# EAGLE design boardShildSchematic (EAGLE 6.6.0)
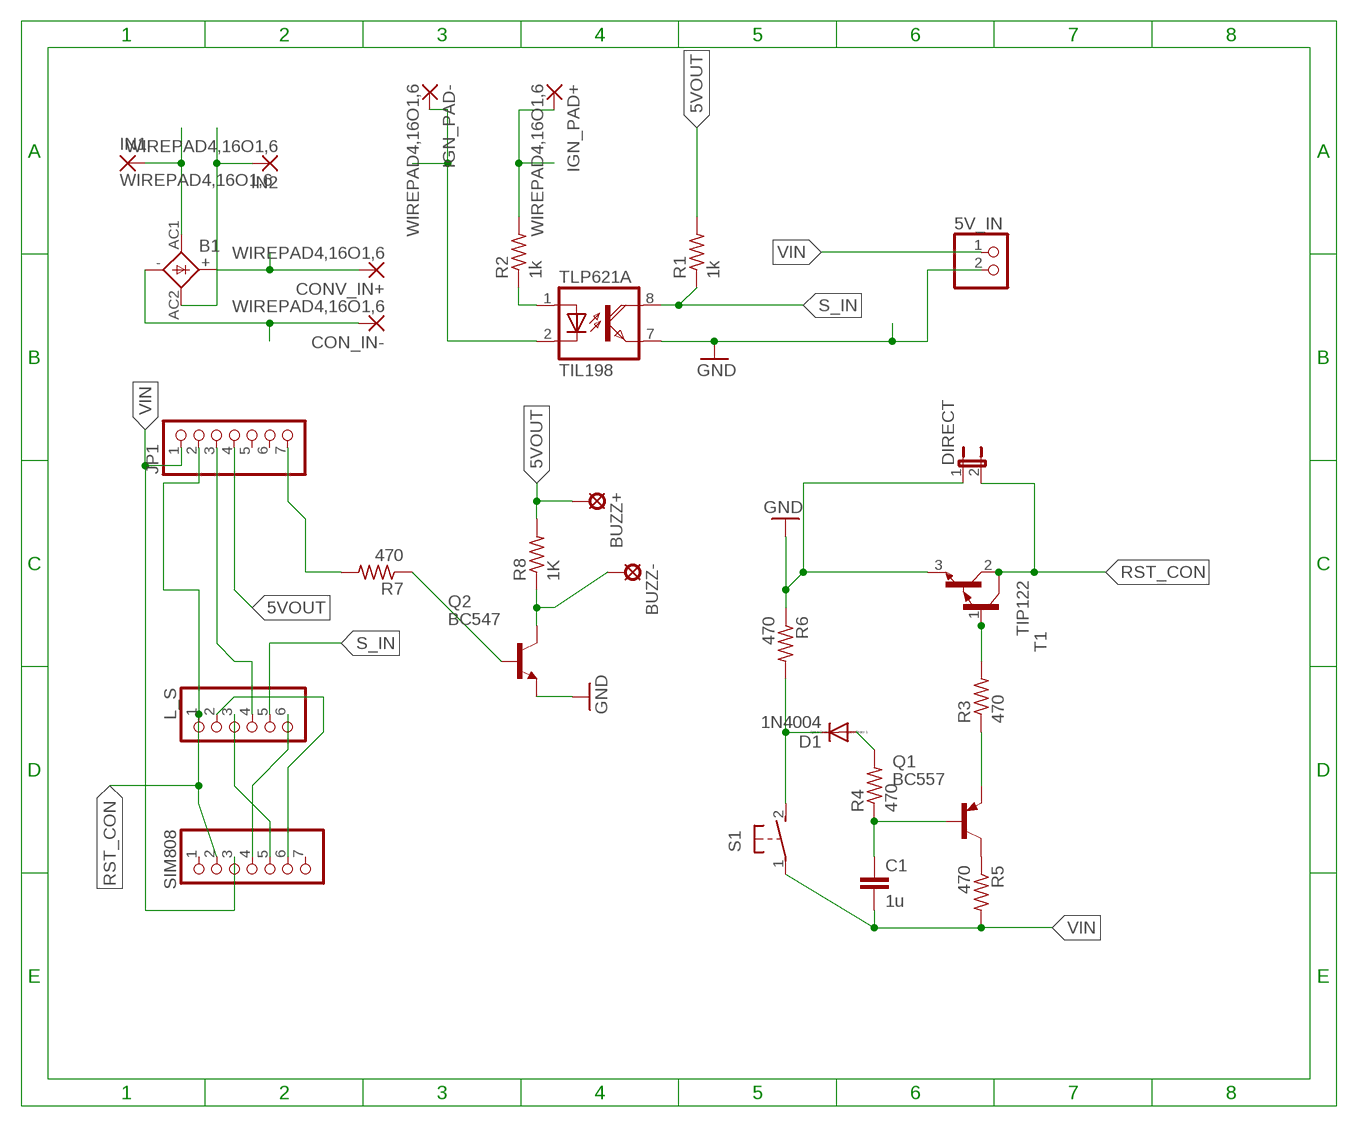
[diagram p0: schematic, sheet 1]

## Parts
5V_IN  PINHD-1X2  [1X02]
B1  FB15  [FB15]
BUZZ+  LSP10  [LSP10]
BUZZ-  LSP10  [LSP10]
C1  1u  C2.5/5  [C2.5-5]
CON_IN-  WIREPAD4,16O1,6  [4,16O1,6]
CONV_IN+  WIREPAD4,16O1,6  [4,16O1,6]
D1  1N4004  [DO41-10]
DIRECT  JP1E  [JP1]
IGN_PAD+  WIREPAD4,16O1,6  [4,16O1,6]
IGN_PAD-  WIREPAD4,16O1,6  [4,16O1,6]
IN1  WIREPAD4,16O1,6  [4,16O1,6]
IN2  WIREPAD4,16O1,6  [4,16O1,6]
JP1  PINHD-1X7  [1X07]
L_S  PINHD-1X6  [1X06]
Q1  BC557  [TO92]
Q2  BC547  [TO92]
R1  1k  R-US_0204/5  [0204/5]
R2  1k  R-US_0204/5  [0204/5]
R3  470  R-US_0204/5  [0204/5]
R4  470  R-US_0204/5  [0204/5]
R5  470  R-US_0204/5  [0204/5]
R6  470  R-US_0204/5  [0204/5]
R7  470  R-US_0204/5  [0204/5]
R8  1K  R-US_0204/5  [0204/5]
S1  31-XX  [B3F-31XX]
SIM808  PINHD-1X7  [1X07]
T1  TIP122  [TO220]
TLP621  TIL198  [DIL08]

## Nets
5VOUT: BUZZ+.MP JP1.4 R1.2 R8.2
GND: 5V_IN.2 DIRECT.1 Q2.1(E) R6.1 T1.3(E) TLP621.7(A:EMI)
N$1: R2.1 TLP621.1(A:A)
N$2: B1.AC1 IN1.1(P)
N$3: IGN_PAD+.1(P) R2.2
N$4: JP1.3 L_S.4
N$5: L_S.2 SIM808.6
N$7: B1.- CON_IN-.1(P)
N$8: L_S.3 SIM808.5
N$9: L_S.6 SIM808.4
N$10: IGN_PAD-.1(P) TLP621.2(A:C)
N$11: Q2.2(B) R7.1
N$12: B1.AC2 IN2.1(P)
N$13: D1.A R4.2
N$14: C1.1 Q1.2(B) R4.1
N$15: B1.+ CONV_IN+.1(P)
N$16: Q1.3(C) R5.1
N$17: Q1.1(E) R3.1
N$18: D1.C R6.2 S1.2(S)
N$19: JP1.7 R7.2
N$20: R3.2 T1.1(B)
N$21: BUZZ-.MP Q2.3(C) R8.1
RST_CON: DIRECT.2 JP1.2 L_S.1 SIM808.2 T1.2(C)
S_IN: L_S.5 R1.1 TLP621.8(A:COL)
VIN: 5V_IN.1 C1.2 JP1.1 R5.2 S1.1(P) SIM808.3
Unconnected: JP1.5 JP1.6 SIM808.1 SIM808.7 TLP621.3(B:A) TLP621.4(B:C) TLP621.5(B:EMI) TLP621.6(B:COL)

## Library data of the parts
5V_IN = pinhead:PINHD-1X2: PIN HEADER
B1 = rectifier:FB15: FAGOR RECTIFIER grid 3 x 5 mm
BUZZ+ BUZZ- = solpad:LSP10: SOLDER PAD drill 1.0 mm, distributor Buerklin, 12H555
C1 = capacitor-wima:C: CAPACITOR naming: grid - package width
CON_IN- CONV_IN+ IGN_PAD+ IGN_PAD- IN1 IN2 = wirepad:WIREPAD: Wire PAD connect wire on PCB
D1 = diode:1N4004: DIODE general purpose rectifier, 1 A
DIRECT = jumper:JP1E: JUMPER
JP1 SIM808 = pinhead:PINHD-1X7: PIN HEADER
L_S = pinhead:PINHD-1X6: PIN HEADER
Q1 = transistor-pnp:BC557: PNP Transistor
Q2 = transistor-npn:BC547*: NPN Transistor
R1-R8 = rcl:R-US_: RESISTOR, American symbol
S1 = switch-omron:31-XX: OMRON SWITCH; MPN: B3F-3100; OC_FARNELL: 959704; OC_NEWARK: 36M3582
T1 = transistor:TIP122: NPN BIPOLAR DARLINGTON TRANSISTOR
TLP621 = optocoupler:TIL198: TEXAS INSTRUMENTS OPTO COUPLER; OC_FARNELL: unknown; OC_NEWARK: unknown

## Board
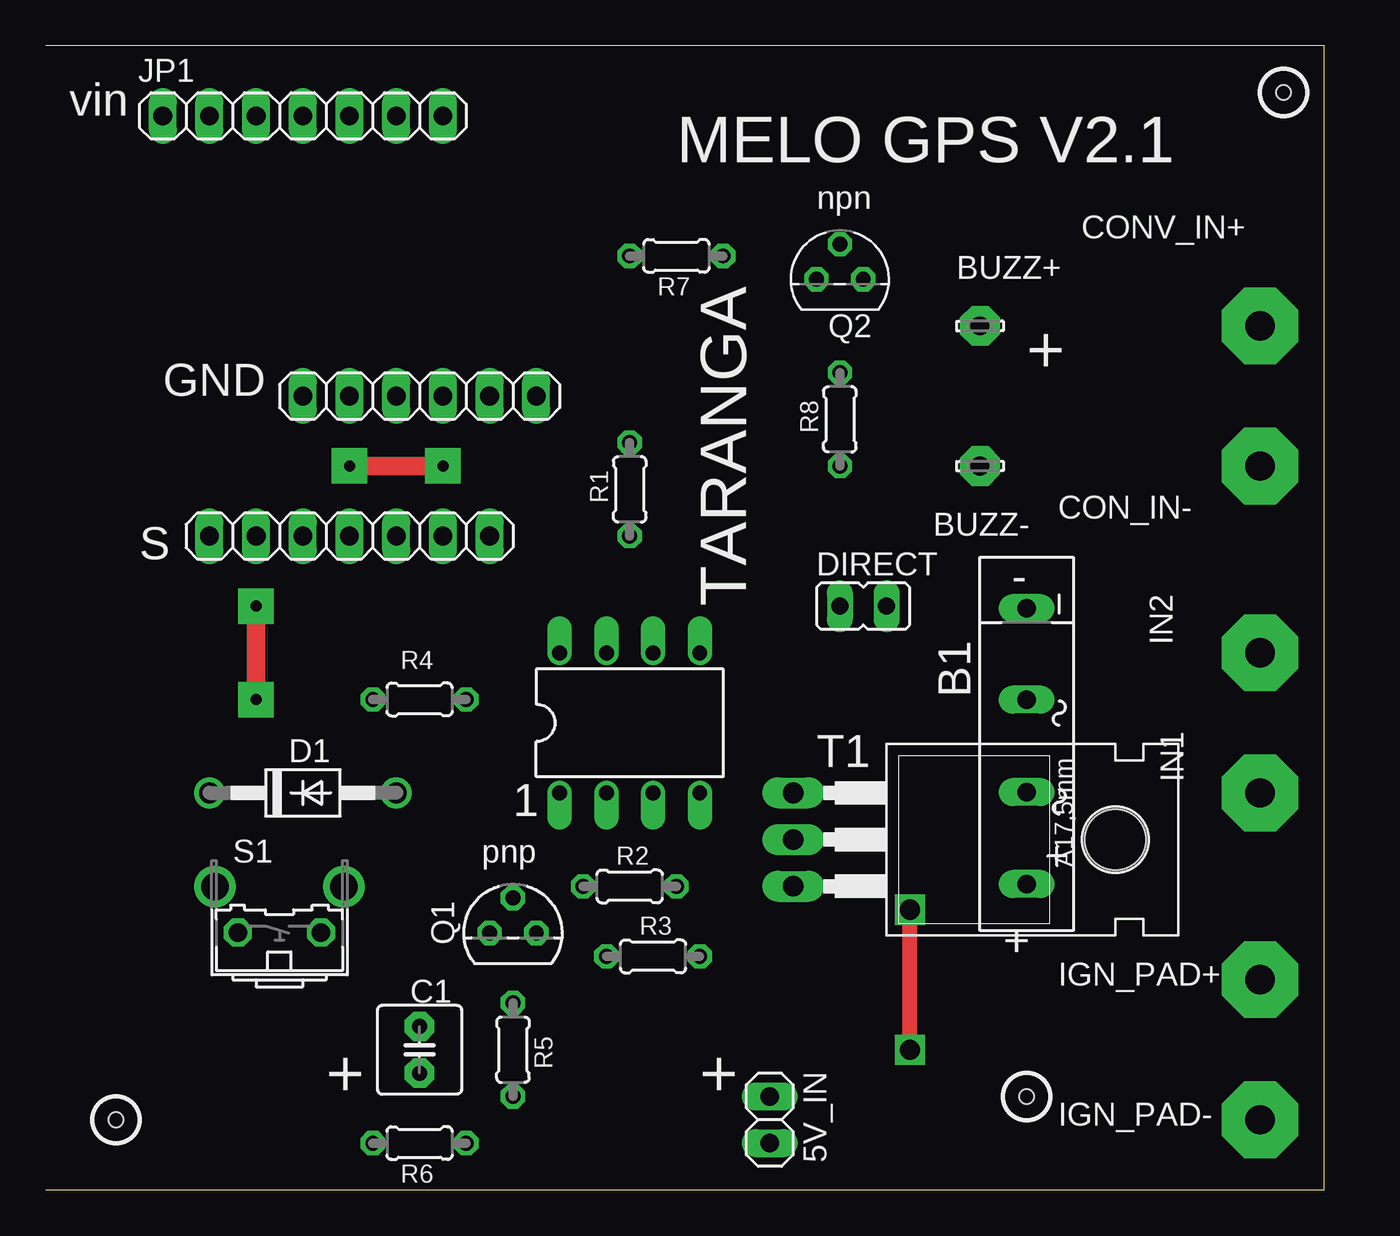
[diagram p1: board, top side]
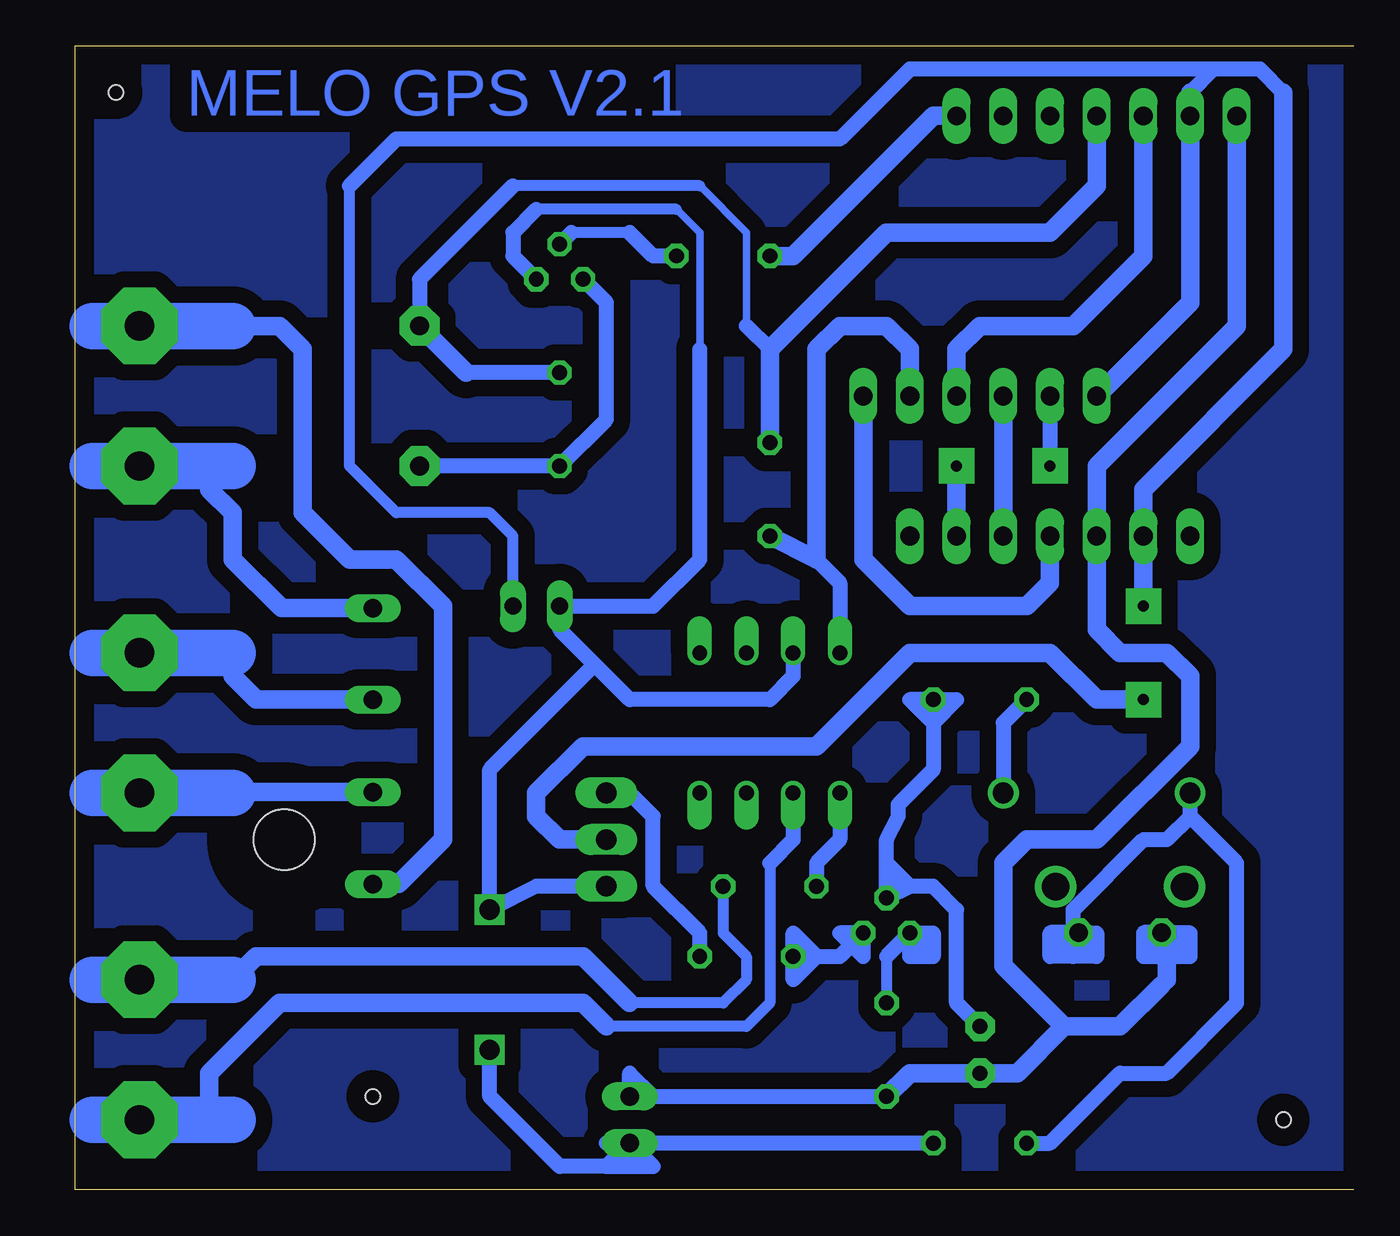
[diagram p2: board, bottom side, seen from below]

Size 69.52 x 62.22 mm. Coordinates in mm from the lower left corner, seen from the top.
Outline: 0,0 69.52,0 69.52,62.22 0,62.22
Copper layers (1*16): Top 0.035mm / dielectric 1.5mm / Bottom 0.035mm
Design rules "default *": minimum track width 10mil, minimum drill 24mil, track to track 35mil, track to pad 25mil, pad to pad 15mil, via to via 15mil, smd to smd 25mil, copper to edge 40mil, drill to drill 8mil, minimum pad ring 10mil, minimum via ring 8mil, stop-mask expansion 4mil, vias tented up to drill 0mil, thermal gap 10mil
Holes 0.8 mm at 67.31,59.69 53.34,5.08 3.81,3.81

### Footprints (pad centres in the part's own frame; a part is rotated, then mirrored left to right if it is on the bottom)
1X02 = drill 1.016 long: 1 -1.27,0; 2 1.27,0
FB15 = drill 1.016 long: + -7.5,0; - 7.511,0; AC1 -2.496,0; AC2 2.533,0
LSP10 = drill 1.016 pad 2.159 octagon: MP 0,0
C2.5-5 = drill 0.813 pad 1.6 octagon: 1 -1.27,0; 2 1.27,0
4,16O1,6 = drill 1.6 pad 4.166 octagon: 1 0,0
DO41-10 = drill 1.118: A 5.08,0; C -5.08,0
JP1 = drill 0.914 long: 1 0,-1.27; 2 0,1.27
1X07 = drill 1.016 long: 1 -7.62,0; 2 -5.08,0; 3 -2.54,0; 4 0,0; 5 2.54,0; 6 5.08,0; 7 7.62,0
1X06 = drill 1.016 long: 1 -6.35,0; 2 -3.81,0; 3 -1.27,0; 4 1.27,0; 5 3.81,0; 6 6.35,0
TO92 = drill 0.813 octagon: 1 1.27,0; 2 0,1.905; 3 -1.27,0
0204/5 = drill 0.813 octagon: 1 -2.54,0; 2 2.54,0
B3F-31XX = drill 1.016 octagon: 1 -2.261,-1.245; 2 2.261,-1.245 | drill 1.499 pad 2.159: 3 -3.505,1.245; 4 3.505,1.245
TO220 = drill 1.118 long: 1 -2.54,-6.35; 2 0,-6.35; 3 2.54,-6.35 | hole 3.302: 0,11.176
DIL08 = drill 0.813 offset: 1 -3.81,-3.81; 2 -1.27,-3.81; 3 1.27,-3.81; 4 3.81,-3.81; 5 3.81,3.81; 6 1.27,3.81; 7 -1.27,3.81; 8 -3.81,3.81

### Placement (x,y rotation side)
5V_IN  39.37,3.81 270 top
B1  53.34,24.13 90 top
BUZZ+  50.8,46.99 0 top
BUZZ-  50.8,39.37 0 top
C1  20.32,7.62 270 top
CON_IN-  66.04,39.37 0 top
CONV_IN+  66.04,46.99 0 top
D1  13.97,21.59 0 top
DIRECT  44.45,31.75 270 top
IGN_PAD+  66.04,11.43 0 top
IGN_PAD-  66.04,3.81 0 top
IN1  66.04,21.59 0 top
IN2  66.04,29.21 0 top
JP1  13.97,58.42 0 top
L_S  20.32,43.18 0 top
Q1  25.4,13.97 0 top
Q2  43.18,49.53 0 top
R1  31.75,38.1 90 top
R2  31.75,16.51 0 top
R3  33.02,12.7 0 top
R4  20.32,26.67 180 top
R5  25.4,7.62 270 top
R6  20.32,2.54 180 top
R7  34.29,50.8 180 top
R8  43.18,41.91 90 top
S1  12.7,15.24 0 top
SIM808  16.51,35.56 0 top
T1  46.99,19.05 270 top
TLP621  31.75,25.4 0 top

### Tracks (layer width: path | path; a pad name or v marks a point on that pad's centre or on a via)
5VOUT
  Bottom 0.406: 33.02,46.99 33.02,52.07 35.56,54.61
  Bottom 0.61: 35.56,54.61 45.72,54.61
  Bottom 0.813: R8.2 48.26,44.45 | 31.75,45.72 33.02,46.99 | 45.72,54.61 50.8,49.53 BUZZ+.MP
  Bottom 1.016: R1.2 31.75,45.72 25.4,52.07 16.51,52.07 13.97,54.61 JP1.4 | 48.26,44.45 BUZZ+.MP
GND  (via drill 0.6, 1.1)
  Top 0.813: v46.99,7.62 v46.99,15.24
  Bottom 0.406: 35.56,45.72 35.56,52.07 36.83,53.34
  Bottom 0.61: 36.83,53.34 44.45,53.34
  Bottom 0.813: TLP621.7 30.48,27.94 31.75,26.67 39.37,26.67 41.27,28.58 | R6.1 5V_IN.2 | 38.1,1.27 5V_IN.2 | 38.1,1.27 40.64,2.54 5V_IN.2 | 5V_IN.2 40.64,1.27 | 40.64,1.27 38.1,1.27 | 40.64,1.27 43.18,1.27 46.99,5.08 v46.99,7.62 | 41.27,28.58 46.99,22.86 v46.99,15.24 44.45,16.51 T1.3 | 41.27,28.58 43.18,30.48 DIRECT.1 38.1,31.75 35.56,34.29 35.56,45.72 | 44.45,53.34 45.72,52.07 45.72,50.8 Q2.1
N$1
  Bottom 0.813: TLP621.1 27.94,19.05 29.21,17.78 R2.1
N$2
  Bottom 1.016: B1.AC1 62.19,21.63 IN1.1
  Bottom 2.54: 68.58,21.59 IN1.1 60.96,21.59
N$3
  Bottom 0.61: R2.2 34.29,13.97 33.02,12.7 33.02,11.43 34.29,10.16 39.37,10.16
  Bottom 1.016: 39.37,10.16 41.91,12.7 59.69,12.7 60.96,11.43
  Bottom 2.54: 68.58,11.43 IGN_PAD+.1 60.96,11.43
N$4
  Bottom 1.016: L_S.4 21.59,45.72 20.32,46.99 15.24,46.99 11.43,50.8 JP1.3
N$5  (via drill 0.5 pad 1.93, 0.6)
  Top 1.016: v16.51,39.37 v21.59,39.37
  Bottom 0.813: L_S.2 v16.51,39.37
  Bottom 1.016: v21.59,39.37 SIM808.6
N$6
  pour Bottom: 1.27,62.23 1.27,0 69.85,0 69.85,62.23
N$7
  Bottom 0.813: 62.23,38.1 62.23,39.37
  Bottom 1.016: B1.- 58.31,31.64 60.96,34.29 60.96,36.83 62.23,38.1
  Bottom 2.54: 68.58,39.37 CON_IN-.1 62.23,39.37 60.96,39.37
N$8
  Bottom 1.016: L_S.3 SIM808.5
N$9
  Bottom 1.016: SIM808.4 16.51,33.02 17.78,31.75 24.13,31.75 26.67,34.29 L_S.6
N$10
  Bottom 0.61: 40.64,8.89 33.02,8.89 31.75,10.16 31.75,17.78
  Bottom 0.813: TLP621.2 30.48,19.05 31.75,17.78
  Bottom 1.016: 40.64,8.89 41.91,10.16 58.42,10.16 62.23,6.35 62.23,3.81
  Bottom 2.54: 68.58,3.81 IGN_PAD-.1 62.23,3.81 60.96,3.81
N$11
  Bottom 0.61: 39.37,52.07 42.54,52.07
  Bottom 0.813: R7.1 38.1,50.8 39.37,52.07 | 42.54,52.07 Q2.2
N$12
  Bottom 0.813: 60.96,27.94 60.96,29.21
  Bottom 1.016: B1.AC2 59.68,26.66 60.96,27.94
  Bottom 2.54: 68.58,29.21 IN2.1 60.96,29.21
N$13
  Bottom 0.813: R4.2 19.05,25.4 D1.A
N$14
  Bottom 0.813: 25.4,16.51 Q1.2 24.13,16.51 | 25.4,16.51 25.4,17.78 | 25.4,17.78 24.13,16.51 | 24.13,16.51 25.4,16.51 | 25.4,17.78 25.4,19.05 24.77,20.32 24.77,20.95 22.86,22.86 22.86,25.4 | R4.1 21.59,26.67 22.86,25.4 | 22.86,25.4 R4.1 | R4.1 24.13,26.67 22.86,25.4 | C1.1 21.59,10.16 21.59,15.24 22.86,16.51 24.13,16.51
N$15
  Bottom 1.016: B1.+ 51.95,16.63 49.53,19.05 49.53,31.75 52.07,34.29 54.61,34.29 57.15,36.83 57.15,45.72 58.42,46.99 60.96,46.99
  Bottom 2.54: 60.96,46.99 CONV_IN+.1 68.58,46.99
N$16
  Bottom 0.61: 25.4,12.7 R5.1
  Bottom 0.813: Q1.3 22.86,13.97 22.86,12.7 | 22.86,12.7 24.13,12.7 Q1.3 | 22.86,12.7 Q1.3 | Q1.3 25.4,12.7
N$17
  Bottom 0.813: R3.1 30.48,13.97 29.21,12.7 30.48,11.43 R3.1 | R3.1 27.94,12.7 Q1.1 | Q1.1 27.94,13.97 26.67,12.7 Q1.1
N$18
  Bottom 0.813: S1.2 16.48,13.99 16.51,13.97 | 15.24,13.97 13.97,13.97 13.97,12.7 | 16.51,12.7 16.51,13.97 | 16.51,13.97 15.24,13.97 | 15.24,12.7 16.51,12.7 | 16.51,12.7 15.24,13.97 | 15.24,13.97 13.97,12.7 | 13.97,12.7 15.24,12.7 | 15.24,12.7 15.24,13.97 | 15.24,13.97 15.24,15.24 11.43,19.05 10.16,19.05 8.89,20.32 | 8.89,20.32 D1.C | R6.2 16.51,2.54 12.7,6.35 10.16,6.35 6.35,10.16 6.35,17.78 8.89,20.32
N$19
  Bottom 1.016: JP1.7 22.86,58.42 30.48,50.8 R7.2
N$20
  Bottom 0.813: R3.2 35.56,13.97 38.1,16.51 38.1,20.32 39.37,21.59 T1.1
N$21
  Bottom 0.813: BUZZ-.MP R8.1 40.64,41.91 40.64,48.26 Q2.3
RST_CON  (via drill 0.5 pad 1.93, 0.6)
  Top 1.016: v11.43,26.67 v11.43,31.75
  Bottom 0.61: DIRECT.2 45.72,35.56 46.99,36.83 52.07,36.83 54.61,39.37 54.61,54.61
  Bottom 0.813: 3.81,59.69 5.08,60.96 7.62,60.96 | 8.89,59.69 7.62,60.96 | 7.62,60.96 24.13,60.96 27.94,57.15 52.07,57.15 54.61,54.61
  Bottom 1.016: L_S.1 8.89,48.26 JP1.2 8.89,59.69 | 3.81,59.69 3.81,45.72 11.43,38.1 SIM808.2 v11.43,31.75 | T1.2 43.18,19.05 44.45,20.32 44.45,21.59 41.91,24.13 29.21,24.13 24.13,29.21 16.51,29.21 13.97,26.67 v11.43,26.67
S_IN
  Bottom 0.813: 29.21,34.29 27.94,33.02 TLP621.8
  Bottom 1.016: L_S.5 24.13,45.72 25.4,46.99 27.94,46.99 29.21,45.72 29.21,34.29 R1.1
VIN
  Bottom 0.813: S1.1 11.41,13.99 11.43,13.97 11.43,12.7 | 10.16,12.7 8.89,12.7 | 8.89,12.7 8.89,13.97 10.16,13.97 | 10.16,12.7 10.16,13.97 | 10.16,13.97 11.43,12.7 | 11.43,12.7 10.16,12.7 | 8.89,12.7 10.16,13.97 | 10.16,11.43 10.44,11.15 | 5V_IN.1 39.37,6.35 38.1,5.08 R5.2
  Bottom 1.016: R5.2 24.13,6.35 C1.2 18.29,6.35 15.75,8.89 | 10.44,11.15 12.7,8.89 15.75,8.89 | 15.75,8.89 19.05,12.19 19.05,17.78 17.78,19.05 13.97,19.05 8.89,24.13 8.89,27.94 10.16,29.21 12.7,29.21 13.97,30.48 SIM808.3 13.97,39.37 6.35,46.99 JP1.1 | 10.16,12.7 10.16,11.43

### Text on the board
Bottom: MELO GPS V2.1
tPlace: MELO GPS V2.1 | npn | + | TARANGA | pnp | + | +
tNames: vin | GND | S | - | 1 | +